# Altium schematic sheet qse_blank.SchDoc
size Letter; SheetNumber: 4; SheetTotal: 9
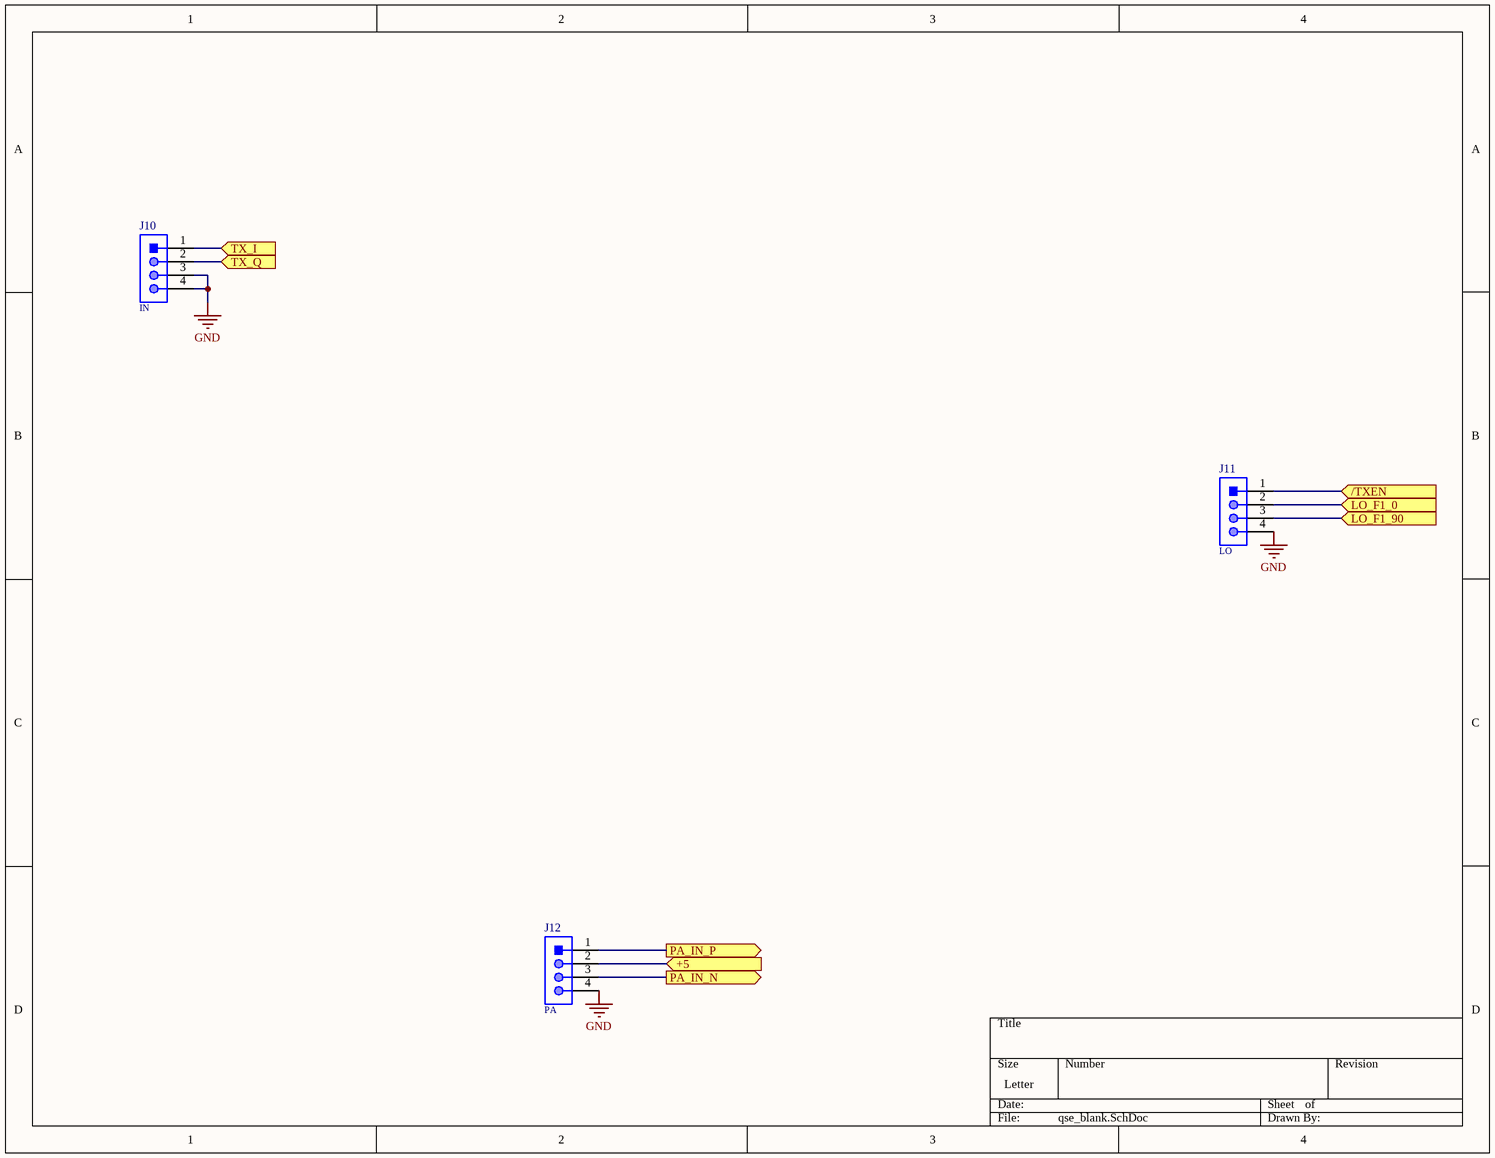
[diagram p0: qse_blank.SchDoc]

## Parts
J10  IN  [61300411121]
J11  LO  [61300411121]
J12  PA  [61300411121]

## Ports
+5 (in), /TXEN (in), LO_F1_0 (in), LO_F1_90 (in), PA_IN_N (out), PA_IN_P (out), TX_I (in), TX_Q (in)

## Nets
GND: J10.3 J10.4 J11.4 J12.4
+5: J12.2 ; port +5
/TXEN: J11.1 ; port /TXEN
LO_F1_0: J11.2 ; port LO_F1_0
LO_F1_90: J11.3 ; port LO_F1_90
PA_IN_N: J12.3 ; port PA_IN_N
PA_IN_P: J12.1 ; port PA_IN_P
TX_I: J10.1 ; port TX_I
TX_Q: J10.2 ; port TX_Q

## Library data of the parts
J10-J12 = CMP-1502-01064-1: THT Vertical Pin Header WR-PHD, Pitch 2.54 mm, Single Row, 4 pins; Manufacturer: Wurth Elektronik; Withstanding Voltage: 500VAC; Rated Current: 3A; Working Voltage: 250VAC; Pin Number: 4; Gender: Male; Contact Resistance: 20mOhm; Pitch: 2.54mm; Manufacturer URL: http://www.we-online.de; Operating Temperature: -40to105degC; Packaging: Bag; Mounting Technology: THT; Package Reference: 61300411121; Datasheet URL: https://katalog.we-online.de/em/datasheet/6130xx11121.pdf; Publisher: WurthElektronik; Part Number: 61300411121; Row Number: Single; Orientation: Vertical